# Altium schematic sheet Sheet1.SchDoc
size A4; SheetNumber: 1; SheetTotal: 1
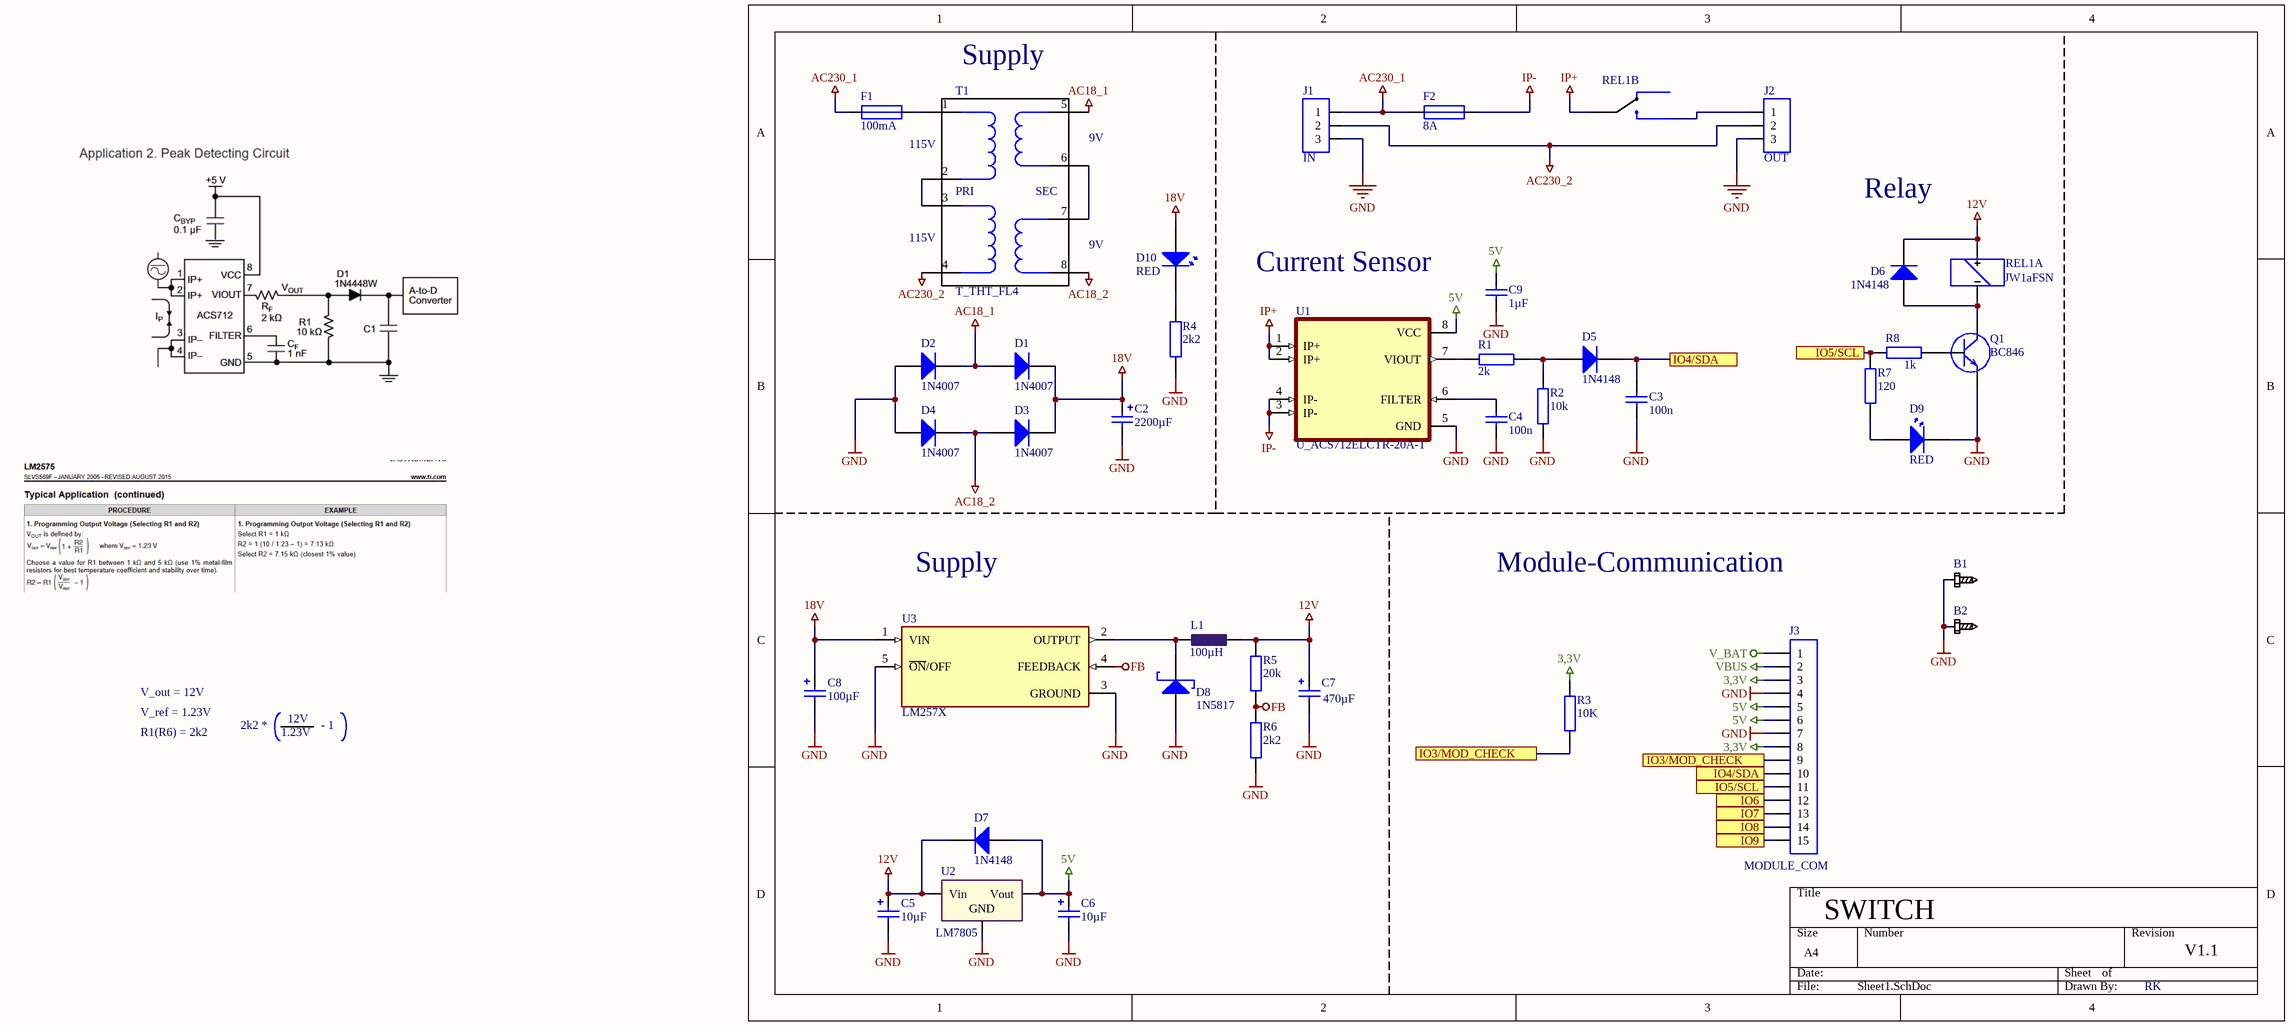
[diagram p0: Sheet1.SchDoc]

## Parts
B1  Schraube  [B_Schraube-M3 PAD]  (value not drawn)
B2  Schraube  [B_Schraube-M3 PAD]  (value not drawn)
C2  2200µF  [C_THT_RB-.3/.6]
C3  100n  [C_SMD_0603]
C4  100n  [C_SMD_0603]
C5  10µF  [C_SMD_B-Typ]
C6  10µF  [C_SMD_B-Typ]
C7  470µF  [C_SMD_B-Typ]
C8  100µF  [C_SMD_B-Typ]
C9  1µF  [C_SMD_0805]
D1  1N4007  [D_THT_0.4]
D2  1N4007  [D_THT_0.4]
D3  1N4007  [D_THT_0.4]
D4  1N4007  [D_THT_0.4]
D5  1N4148  [SOD-80-2]
D6  1N4148  [SOD-80-2]
D7  1N4148  [SOD-80-2]
D8  1N5817  [D_THT_0.6]
D9  RED  [D_THT_LED-3]
D10  RED  [D_THT_LED-3]
F1  100mA  [F_THT_Fuse2pol]
F2  8A  [F_THT_Fuse2pol]
J1  IN  [J_THT_Printklemme 3x]
J2  OUT  [J_THT_Printklemme 3x]
J3  MODULE_COM  [SIP-15_Node_V2]
L1  100µH  [L_SMD_NPIS42LS]
Q1  BC846  [SOT-23-3_BC846]
R1  2k  [R_SMD_0805]
R2  10k  [R_SMD_0805]
R3  10K  [R_SMD_0805]
R4  2k2  [R_SMD_0805]
R5  20k  [R_SMD_0805]
R6  2k2  [R_SMD_0805]
R7  120  [R_SMD_0805]
R8  1k  [R_SMD_0805]
REL1  JW1aFSN  [Rel_THT_1x 2]  (parts A,B of 2)
T1  T_THT_FL4  [FL_4_Trafo]
U1  U_ACS712ELCTR-20A-T  [SO-8]
U2  LM7805  [TO-220-3H]
U3  LM257X  [TO220-5V]

## Ports
IO3/MOD_CHECK (see Sheet1[2C]), IO3/MOD_CHECK (see Sheet1[3C]), IO4/SDA (see Sheet1[3B]), IO4/SDA (see Sheet1[3D]), IO5/SCL (see Sheet1[3B]), IO5/SCL (see Sheet1[3D]), IO6, IO7, IO8, IO9

## Nets
3,3V: J3.3 J3.8 R3.2
5V: C6.1 C9.1 D7.1(A) J3.5 J3.6 U1.8(VCC) U2.2(Vout)
12V: C5.1 C7.1 D6.2(K) D7.2(K) L1.1 R5.1 REL1.1(+) U2.1(Vin)
18V: C2.1 C8.1 D1.2(K) D3.2(K) D10.1(A) U3.1(VIN)
AC18_1: D1.1(A) D2.2(K) T1.5
AC18_2: D3.1(A) D4.2(K) T1.8
AC230_1: F1.1 F2.1 J1.1
AC230_2: J1.2 J2.2 T1.4
FB: R5.2 R6.1 U3.4(FEEDBACK)
GND: B1.1(PAD) B2.1(PAD) C2.2 C3.2 C4.2 C5.2 C6.2 C7.2 C8.2 C9.2 D2.1(A) D4.1(A) D8.1(A) D9.2(K) J1.3 J2.3 J3.4 J3.7 Q1.E R2.2 R4.2 R6.2 U1.5(GND) U2.3(GND) U3.3(GROUND) U3.5(~{ON}/OFF)
IP+: REL1.3 U1.1(IP+) U1.2(IP+)
IP-: F2.2 U1.3(IP-) U1.4(IP-)
V_BAT: J3.1
VBUS: J3.2
IO3/MOD_CHECK: J3.9 R3.1 ; port IO3/MOD_CHECK
IO4/SDA: C3.1 D5.2(K) J3.10 ; port IO4/SDA
IO5/SCL: J3.11 R7.1 R8.1 ; port IO5/SCL
IO6: J3.12 ; port IO6
IO7: J3.13 ; port IO7
IO8: J3.14 ; port IO8
IO9: J3.15 ; port IO9
NetC4_1: C4.1 U1.6(FILTER)
NetD5_1: D5.1(A) R1.1 R2.1
NetD6_1: D6.1(A) Q1.C REL1.2
NetD8_2: D8.2(K) L1.2 U3.2(OUTPUT)
NetD9_1: D9.1(A) R7.2
NetD10_2: D10.2(K) R4.1
NetF1_2: F1.2 T1.1
NetJ2_1: J2.1 REL1.4(NO)
NetQ1_B: Q1.B R8.2
NetR1_2: R1.2 U1.7(VIOUT)
NetT1_2: T1.2 T1.3
NetT1_6: T1.6 T1.7

Not connected (* = marked no-connect by the designer): REL1 5

## Notes on the sheet
- (near T1) Supply
- 115V
- (near T1) 9V
- (near T1) 115V
- Relay
- Current Sensor
- Supply
- Module-Communication
- V_out = 12V
- V_ref = 1.23V
- R1(R6) = 2k2
- 2k2 *
- 1.23V
- 12V
- - 1
- SWITCH
- V1.1
- RK
- (in symbol T_THT_FL4) PRI; SEC

## Library data of the parts
B1 B2 = B_Schraube: Schraubenloch für M3 Schrauben
C2 = C_THT_ELK: THT Elektrolytkondensator; Spannung: *; Bauform: *; Typ: *
C3 C4 C9 = C_SMD_KO: Kondensator SMD Universal, Keramik, Folie, usw.; Spannung: *; Bauform: *; Typ: *
C5-C8 = C_SMD_ELK: SMD Elektrolytkondensator; Spannung: *; Bauform: *; Typ: *
D1-D4 = D_THT_Silizium: Diode THT Silizium; Spannung For.: 0,7V; Spannung Rev.: *; Strom: *
D5-D7 = D_SMD_Silizium: Diode SMD Silizium; Spannung For.: 0,7V; Spannung Rev.: *; Strom: *
D8 = D_THT_Schottky: Diode THT Schottky; Spannung For.: 0,4V; Spannung Rev.: *; Strom: *
D9 D10 = D_THT_LED: Diode THT LED; Spannung For.: 1,8V-3,6V; Spannung Rev.: *; Strom: *
F1 F2 = F_THT_Fuse: Sicherung; Strom: *; Auslösecharakteristik: *
J1 J2 = J_THT_CON3: Stecker
J3 = J_THT_NODE_V2: Stecker
L1 = L_SMD_Spule: Spule SMD
Q1 = Q_SMD_NPN: NPN Transistor
R1-R8 = R_SMD_Widerstand: Widerstand SMD
REL1 = Rel_THT_1x2: Relais 1 Öffner, 1 Schließer
T1 = T_THT_FL4: Flachtrafo von Block 4VA / 2x Primär / 2x Sekundär
U1 = U_ACS712ELCTR-20A-T: Current Sensor 20A 1 Channel Hall Effect, Open Loop Bidirectional 8-SOIC (0.154, 3.90mm Width); MF: Allegro; Value: *; Purchase-URL: https://pricing.snapeda.com/search/part/ACS712ELCTR-20A-T/?ref=eda; Package: SOIC-8 Allegro MicroSystems LLC; Availability: In Stock; Check_prices: https://www.snapeda.com/parts/ACS712ELCTR-20A-T/Allegro+Industries/view-part/?ref=eda; Price: None; SnapEDA_Link: https://www.snapeda.com/parts/ACS712ELCTR-20A-T/Allegro+Industries/view-part/?ref=snap; MP: ACS712ELCTR-20A-T
U2 = U_THT_78xx: Linearwandler
U3 = U_THT_LM25xx: Spanungswandler Step Up/Down